# EAGLE schematic GPS_chip (EAGLE 6.5.0)
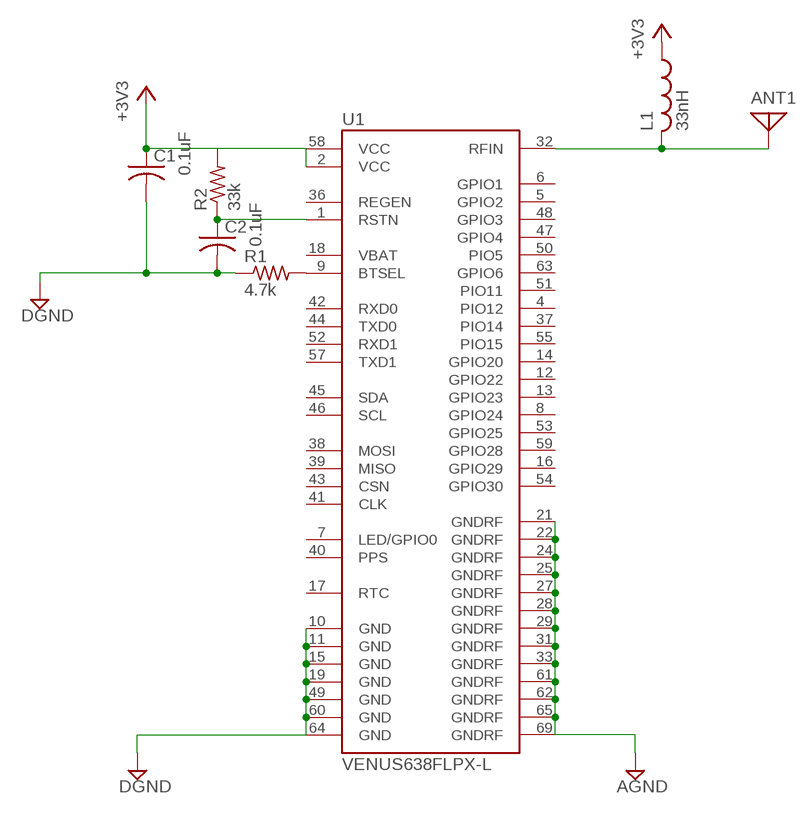
[diagram p0: schematic, sheet 1]

## Parts
ANT1  ANTENNA  [PAD-01]
C1  C-USC0603  [C0603]
C2  C-USC0603  [C0603]
L1  33nH  L-USL4532P  [L4532P]
R1  4.7k  R-US_R0603  [R0603]
R2  33k  R-US_R0603  [R0603]
U1  VENUS638FLPX-L  [VENUS638FLPX]

## Nets
+3V3: C1.1 L1.1 R2.2 U1.2(VCC) U1.58(VCC)
AGND: U1.21(GNDRF) U1.22(GNDRF) U1.24(GNDRF) U1.25(GNDRF) U1.27(GNDRF) U1.28(GNDRF) U1.29(GNDRF) U1.31(GNDRF) U1.33(GNDRF) U1.61(GNDRF) U1.62(GNDRF) U1.65(GNDRF) U1.69(GNDRF)
DGND: C1.2 C2.2 R1.1 U1.10(GND) U1.11(GND) U1.15(GND) U1.19(GND) U1.49(GND) U1.60(GND) U1.64(GND)
N$1: R1.2 U1.9(BTSEL)
N$2: C2.1 R2.1 U1.1(RSTN)
N$3: ANT1.1 L1.2 U1.32(RFIN)
Unconnected: U1.4(PIO12) U1.5(GPIO2) U1.6(GPIO1) U1.7(LED/GPIO0) U1.8(GPIO24) U1.12(GPIO22) U1.13(GPIO23) U1.14(GPIO20) U1.16(GPIO29) U1.17(RTC) U1.18(VBAT) U1.36(REGEN) U1.37(PIO14) U1.38(MOSI) U1.39(MISO) U1.40(PPS) U1.41(CLK) U1.42(RXD0) U1.43(CSN) U1.44(TXD0) U1.45(SDA) U1.46(SCL) U1.47(GPIO4) U1.48(GPIO3) U1.50(PIO5) U1.51(PIO11) U1.52(RXD1) U1.53(GPIO25) U1.54(GPIO30) U1.55(PIO15) U1.57(TXD1) U1.59(GPIO28) U1.63(GPIO6)

## Library data of the parts
ANT1 = discrete:ANTENNA: Antenna
C1 C2 = rcl:C-US: CAPACITOR, American symbol; CAP: 0.1uF
L1 = rcl:L-US: INDUCTOR, American symbol
R1 R2 = rcl:R-US_: RESISTOR, American symbol
U1 = SparkFun-RF:VENUS638FLPX-L: Venus638FLPX-L GPS Receiver Venus638FLPx is a high performance, low cost, single chip GPS receiver targeting mobile consumer and cellular handset applications. It offers very low power consumption, high sensitivity, and best in class signal acquisition and time-to-first-fix performance. Venus638FLPx contains all the necessary components of a complete GPS receiver, includes 1.2dB cascaded system NF RF front-end, GPS baseband signal processor, 0.5ppm TCXO, 32.768kHz RTC crystal, RTC LDO regulator, and passive components. It requires very low external component count and takes up only 100mm2 PCB footprint. Dedicated massive-correlator signal parameter search engine within the baseband enables rapid search of all the available satellites and acquisition of very weak signal. An advanced track engine allows weak signal tracking and positioning in harsh environments such as urban canyons and under deep foliage. The self-contained architecture keeps GPS processing off the host and allows integration into applications with very little resource. FEATURES 20Hz update rate -148dBm cold start sensitivity -165dBm tracking sensitivity 29 second cold start TTFF 3.5 second TTFF with AGPS 1 second hot start 2.5m accuracy Multipath detection and suppression Jamming detection and mitigation SBAS (WAAS / EGNOS) support 7-day extended ephemeris AGPS 67mW full power navigation Works directly with active or passive antenna Internal flash for optional 75K point data logging Supports external SPI flash memory data logging Complete receiver in 10mm x 10mm x 1.3mm size Contains LNA, SAW Filter, TCXO, RTC Xtal, LDO Pb-free RoHS compliant